# Altium schematic sheet SouldBoard.SchDoc
size A4
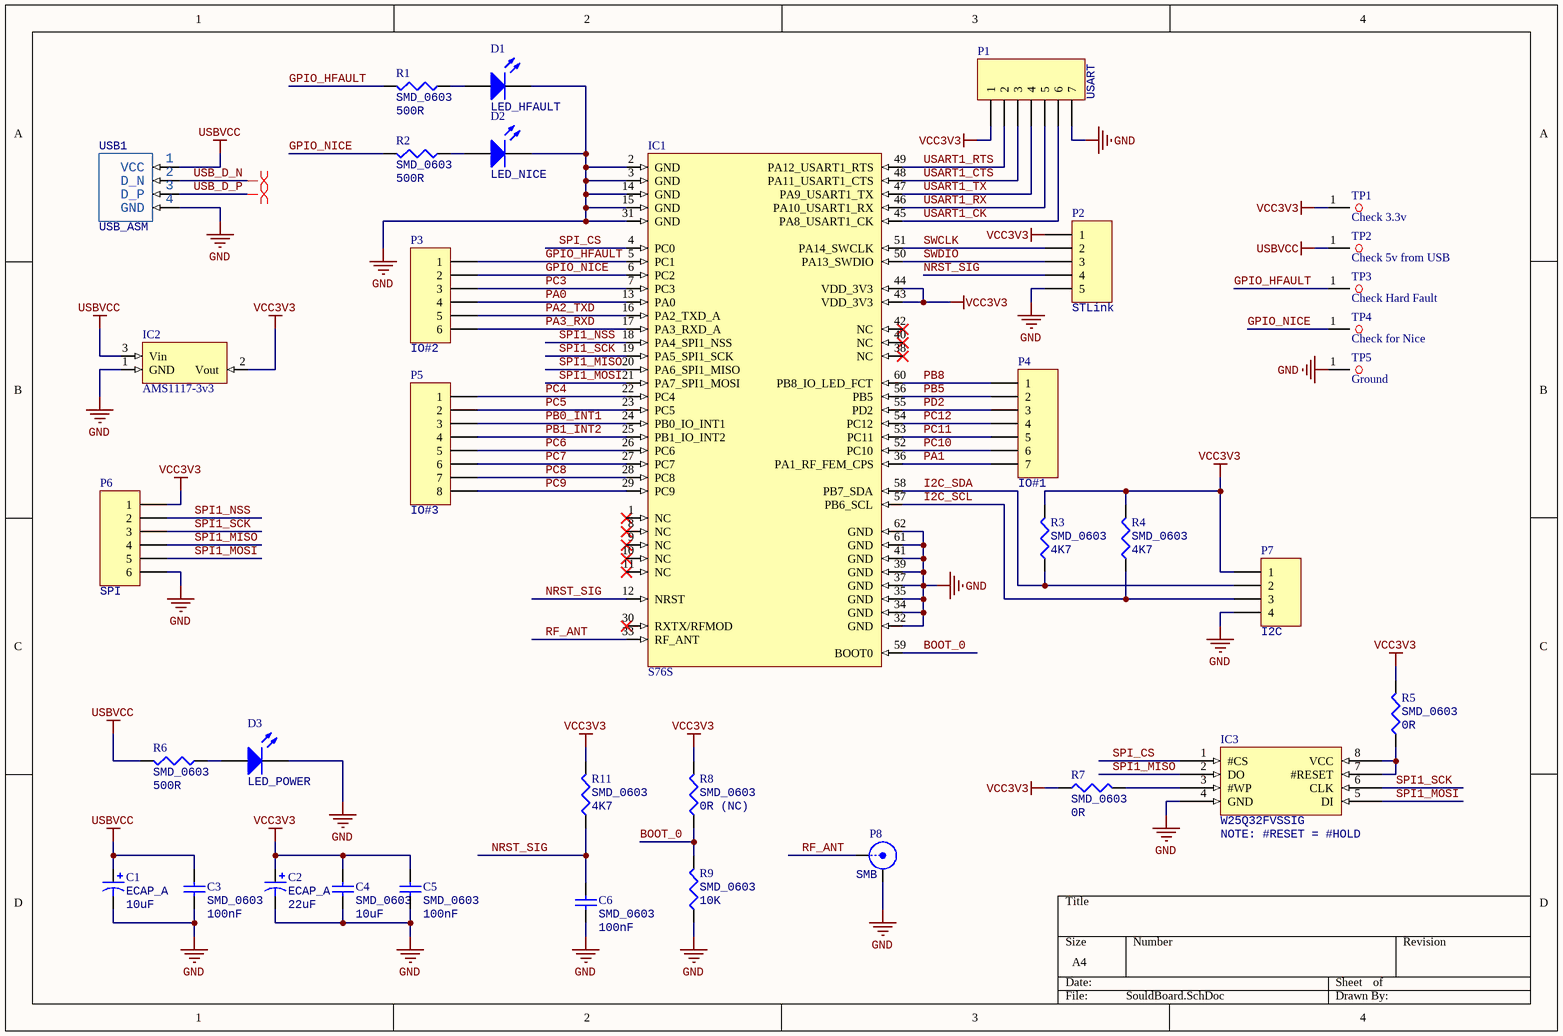
[diagram p0: SouldBoard.SchDoc]

## Parts
C1  ECAP_A  value 10uF  [CAPAE4645X63M]
C2  ECAP_A  value 22uF  [CAPAE4645X63M]
C3  SMD_0603  value 100nF  [1608[0603]]
C4  SMD_0603  value 10uF  [1608[0603]]
C5  SMD_0603  value 100nF  [1608[0603]]
C6  SMD_0603  value 100nF  [1608[0603]]
D1  LED_HFAULT  [3.5X2.8X1.9]
D2  LED_NICE  [3.5X2.8X1.9]
D3  LED_POWER  [3.5X2.8X1.9]
IC1  S76S  [S76S]
IC2  AMS1117-3v3  [SOT223]
IC3  W25Q32FVSSIG  [SOIC8_208mil]
P1  USART  [HDR1X7]
P2  STLink  [HDR1X5]
P3  IO#2  [HDR1X6]
P4  IO#1  [HDR1X7]
P5  IO#3  [HDR1X8]
P6  SPI  [HDR1X6]
P7  I2C  [HDR1X4]
P8  SMB  [SMB_V-RJ45]
R1  SMD_0603  value 500R  [J1-0603]
R2  SMD_0603  value 500R  [J1-0603]
R3  SMD_0603  value 4K7  [J1-0603]
R4  SMD_0603  value 4K7  [J1-0603]
R5  SMD_0603  value 0R  [J1-0603]
R6  SMD_0603  value 500R  [J1-0603]
R7  SMD_0603  value 0R  [J1-0603]
R8  SMD_0603  value 0R (NC)  [J1-0603]
R9  SMD_0603  value 10K  [J1-0603]
R11  SMD_0603  value 4K7  [J1-0603]
TP1  Check 3.3v  [TestPoint]
TP2  Check 5v from USB  [TestPoint]
TP3  Check Hard Fault  [TestPoint]
TP4  Check for Nice  [TestPoint]
TP5  Ground  [TestPoint]
USB1  USB_ASM  [PCBComponent_1]

## Nets
GND: C1.2 C2.2 C3.1 C4.1 C5.1 C6.1 D1.2(K) D2.2(K) D3.2(K) IC1.2(GND) IC1.3(GND) IC1.14(GND) IC1.15(GND) IC1.31(GND) IC1.32(GND) IC1.34(GND) IC1.35(GND) IC1.37(GND) IC1.39(GND) IC1.41(GND) IC1.61(GND) IC1.62(GND) IC2.1(GND) IC3.4(GND) P1.7 P2.5 P6.6 P7.4 P8.2(Y) R9.1 TP5.1 USB1.4(GND)
USBVCC: C1.1 C3.2 IC2.3(Vin) R6.2 TP2.1 USB1.1(VCC)
VCC3V3: C2.1 C4.2 C5.2 IC1.43(VDD_3V3) IC1.44(VDD_3V3) IC2.2(Vout) P1.1 P2.1 P6.1 P7.1 R3.2 R4.2 R5.2 R7.1 R8.2 R11.2 TP1.1
BOOT_0: IC1.59(BOOT0) R8.1 R9.2
GPIO_HFAULT: IC1.5(PC1) P3.1 R1.2 TP3.1
GPIO_NICE: IC1.6(PC2) P3.2 R2.2 TP4.1
I2C_SCL: IC1.57(PB6_SCL) P7.3 R4.1
I2C_SDA: IC1.58(PB7_SDA) P7.2 R3.1
NRST_SIG: C6.2 IC1.12(NRST) P2.4 R11.1
PA0: IC1.13(PA0) P3.4
PA1: IC1.36(PA1_RF_FEM_CPS) P4.7
PA2_TXD: IC1.16(PA2_TXD_A) P3.5
PA3_RXD: IC1.17(PA3_RXD_A) P3.6
PB0_INT1: IC1.24(PB0_IO_INT1) P5.3
PB1_INT2: IC1.25(PB1_IO_INT2) P5.4
PB5: IC1.56(PB5) P4.2
PB8: IC1.60(PB8_IO_LED_FCT) P4.1
PC3: IC1.7(PC3) P3.3
PC4: IC1.22(PC4) P5.1
PC5: IC1.23(PC5) P5.2
PC6: IC1.26(PC6) P5.5
PC7: IC1.27(PC7) P5.6
PC8: IC1.28(PC8) P5.7
PC9: IC1.29(PC9) P5.8
PC10: IC1.52(PC10) P4.6
PC11: IC1.53(PC11) P4.5
PC12: IC1.54(PC12) P4.4
PD2: IC1.55(PD2) P4.3
RF_ANT: IC1.33(RF_ANT) P8.1(X)
SPI1_MISO: IC1.20(PA6_SPI1_MISO) IC3.2(DO) P6.4
SPI1_MOSI: IC1.21(PA7_SPI1_MOSI) IC3.5(DI) P6.5
SPI1_NSS: IC1.18(PA4_SPI1_NSS) P6.2
SPI1_SCK: IC1.19(PA5_SPI1_SCK) IC3.6(CLK) P6.3
SPI_CS: IC1.4(PC0) IC3.1(#CS)
SWCLK: IC1.51(PA14_SWCLK) P2.2
SWDIO: IC1.50(PA13_SWDIO) P2.3
USART1_CK: IC1.45(PA8_USART1_CK) P1.6
USART1_CTS: IC1.48(PA11_USART1_CTS) P1.3
USART1_RTS: IC1.49(PA12_USART1_RTS) P1.2
USART1_RX: IC1.46(PA10_USART1_RX) P1.5
USART1_TX: IC1.47(PA9_USART1_TX) P1.4
USB_D_N: USB1.2(D_N)
USB_D_P: USB1.3(D_P)
NetD1_1: D1.1(A) R1.1
NetD2_1: D2.1(A) R2.1
NetD3_1: D3.1(A) R6.1
NetIC3_3: IC3.3(#WP) R7.2
NetIC3_7: IC3.7(#RESET) IC3.8(VCC) R5.1

Not connected (* = marked no-connect by the designer): IC1 1(NC)* 8(NC)* 9(NC)* 10(NC)* 11(NC)* 30(RXTX/RFMOD)* 38(NC)* 40(NC)* 42(NC)*

## Layout directives
differential pair: USB_D_N, USB_D_P

## Notes on the sheet
- (near IC3) NOTE: #RESET = #HOLD

## Library data of the parts
C1 C2 = Cap Pol1: Polarized Capacitor (Radial); Published: 8-Jun-2000; LatestRevisionDate: 17-Jul-2002; LatestRevisionNote: Re-released for DXP Platform.; PackageReference: RB7.6-15; Publisher: Altium Limited; PackageDescription: Polarized Capacitor (Radial); 2 Leads
C3-C6 = Cap Semi: Capacitor (Semiconductor SIM Model); Published: 8-Jun-2000; LatestRevisionDate: 29-May-2009; LatestRevisionNote: IPC-7351 Footprint Added.; PackageReference: C1206; Publisher: Altium Limited; PackageDescription: Chip Capacitor
D1-D3 = LED3: Typical BLUE SiC LED; Published: 8-Jun-2000; LatestRevisionDate: 17-Dec-2003; LatestRevisionNote: PCB Footprint replaced.; DatasheetVersion: 16-Apr-2002; PackageVersion: 16-Apr-2002; PackageReference: 3.5X2.8X1.9; Publisher: Altium Limited; PackageDescription: SM LED; 2 C-Bend Leads; Body 3.5 x 2.8 x 1.9 mm, inc leads (LxWxH typ)
IC1 = S76S: LoRa S76S
IC2 = AMS1117_3V3: AMS1117 5v to 3.3v
IC3 = W25Q32FVSSIG: SPI Flash 32Mbit (4MB)
P1 P4 = Header 7: Header, 7-Pin; LatestRevisionDate: 17-Jul-2002; LatestRevisionNote: Re-released for DXP Platform.; Publisher: Altium Limited
P2 = Header 5: Header, 5-Pin; LatestRevisionDate: 17-Jul-2002; LatestRevisionNote: Re-released for DXP Platform.; Publisher: Altium Limited
P3 P6 = Header 6: Header, 6-Pin; LatestRevisionDate: 17-Jul-2002; LatestRevisionNote: Re-released for DXP Platform.; Publisher: Altium Limited
P5 = Header 8: Header, 8-Pin; LatestRevisionDate: 17-Jul-2002; LatestRevisionNote: Re-released for DXP Platform.; Publisher: Altium Limited
P7 = Header 4: Header, 4-Pin; LatestRevisionDate: 17-Jul-2002; LatestRevisionNote: Re-released for DXP Platform.; Publisher: Altium Limited
P8 = SMB: SMB Straight Connector; LatestRevisionDate: 17-Jul-2002; LatestRevisionNote: Re-released for DXP Platform.; Publisher: Altium Limited
R1-R9 R11 = Res3: Resistor; Published: 8-Jun-2000; LatestRevisionDate: 29-May-2009; LatestRevisionNote: IPC-7351 Footprint Added.; PackageReference: J1-0603; Publisher: Altium Limited; PackageDescription: Chip Resistor
TP1-TP5 = TP: Test Point
USB1 = USB_ASM: USB port type ASM